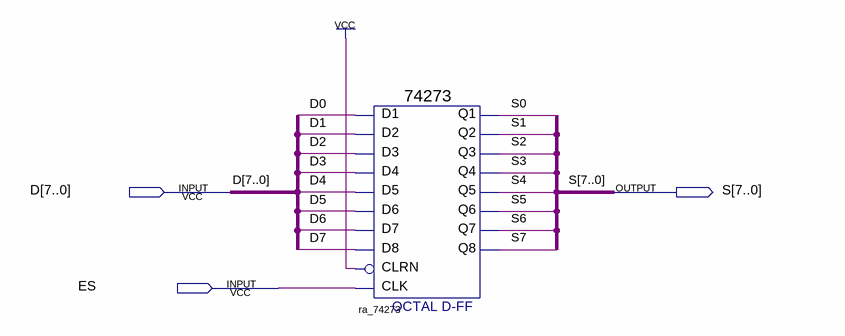
[diagram p0: schematic sheet]
// Quartus schematic RA_RegistradorA.bdf as structural Verilog: 1 symbols, 3 pins
module RA_RegistradorA (
  input  [7:0] D,
  input  ES,
  output [7:0] S
);

  \74273  ra_74273 (
    .D2(D[1]), .D3(D[2]), .D1(D[0]), .D4(D[3]), .D7(D[6]), .D6(D[5]), .D5(D[4]), .D8(D[7]), .CLK(ES),
    .CLRN(1'b1), .Q4(S[3]), .Q1(S[0]), .Q2(S[1]), .Q3(S[2]), .Q6(S[5]), .Q5(S[4]), .Q7(S[6]), .Q8(S[7]));
endmodule
